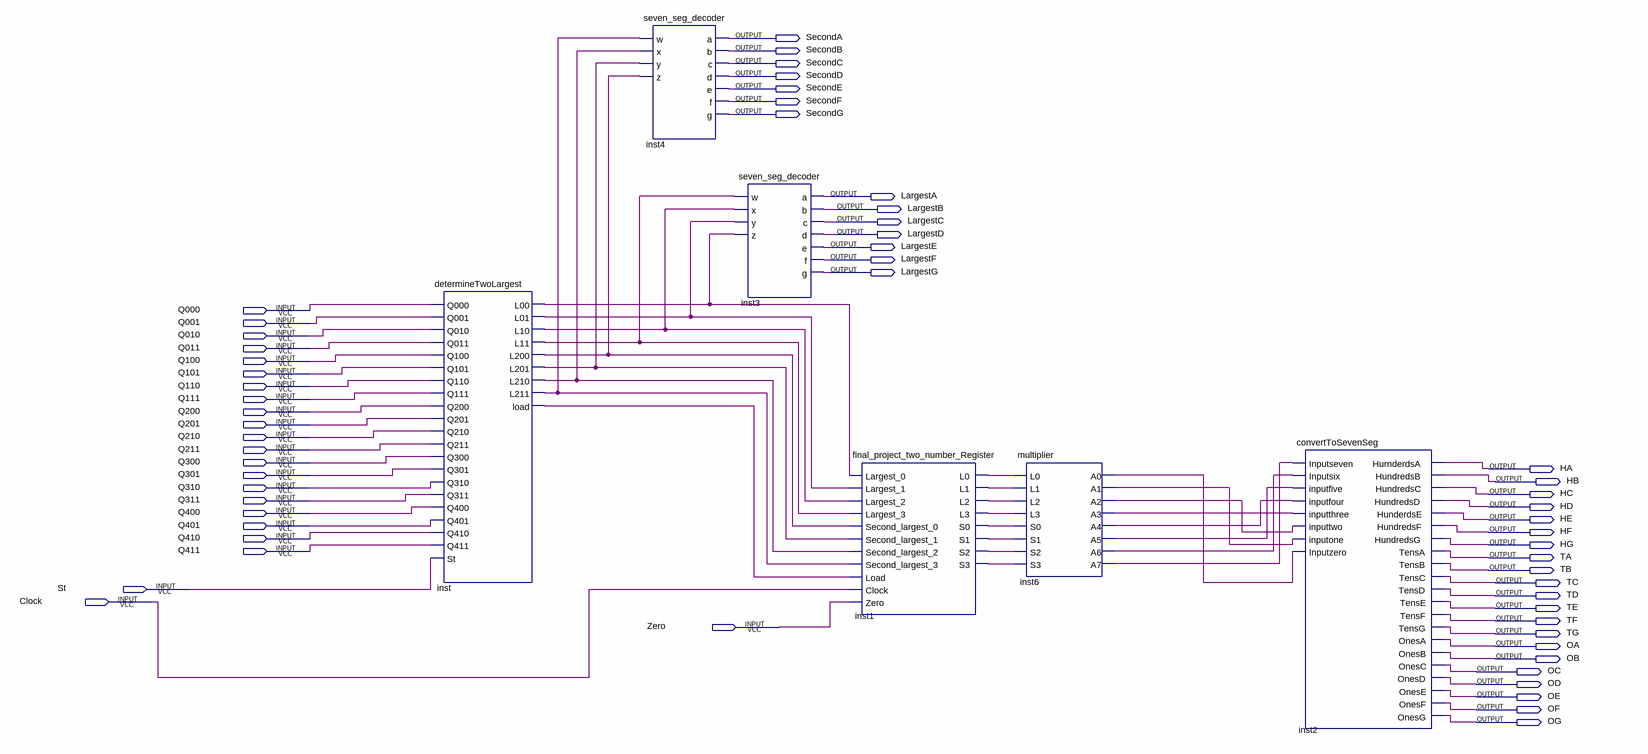
[diagram p0: schematic sheet]
// Quartus schematic Final_Project.bdf as structural Verilog: 6 symbols, 58 pins
module Final_Project (
  input  Q000,
  input  Q001,
  input  Q010,
  input  Q011,
  input  Q100,
  input  Q101,
  input  Q110,
  input  Q111,
  input  Q200,
  input  Q201,
  input  Q210,
  input  Q211,
  input  Q300,
  input  Q301,
  input  Q310,
  input  Q311,
  input  Q400,
  input  Q401,
  input  Q410,
  input  Q411,
  input  St,
  input  Clock,
  input  Zero,
  output SecondA,
  output SecondB,
  output SecondC,
  output SecondD,
  output SecondE,
  output SecondF,
  output SecondG,
  output LargestA,
  output LargestB,
  output LargestC,
  output LargestD,
  output LargestE,
  output LargestF,
  output LargestG,
  output HA,
  output HB,
  output HC,
  output HD,
  output HE,
  output HF,
  output HG,
  output TA,
  output TB,
  output TC,
  output TD,
  output TE,
  output TF,
  output TG,
  output OA,
  output OB,
  output OC,
  output OD,
  output OE,
  output OF,
  output OG
);

  wire inst1_l0, inst1_l1, inst1_l2, inst1_l3, inst1_s0, inst1_s1, inst1_s2, inst1_s3, inst6_a0, inst6_a1,
       inst6_a2, inst6_a3, inst6_a4, inst6_a5, inst6_a6, inst6_a7, inst_l00, inst_l01, inst_l10, inst_l11,
       inst_l200, inst_l201, inst_l210, inst_l211, inst_load;

  determineTwoLargest inst (
    .Q000(Q000), .Q001(Q001), .Q010(Q010), .Q011(Q011), .Q100(Q100), .Q101(Q101), .Q110(Q110), .Q111(Q111),
    .Q200(Q200), .Q201(Q201), .Q210(Q210), .Q211(Q211), .Q300(Q300), .Q301(Q301), .Q310(Q310), .Q311(Q311),
    .Q400(Q400), .Q401(Q401), .Q410(Q410), .Q411(Q411), .St(St), .L00(inst_l00), .L01(inst_l01),
    .L10(inst_l10), .L11(inst_l11), .L200(inst_l200), .L201(inst_l201), .L210(inst_l210), .L211(inst_l211),
    .load(inst_load));
  seven_seg_decoder inst4 (
    .w(inst_l211), .x(inst_l210), .y(inst_l201), .z(inst_l200), .a(SecondA), .b(SecondB), .c(SecondC),
    .d(SecondD), .e(SecondE), .f(SecondF), .g(SecondG));
  seven_seg_decoder inst3 (
    .w(inst_l11), .x(inst_l10), .y(inst_l01), .z(inst_l00), .a(LargestA), .b(LargestB), .c(LargestC),
    .d(LargestD), .e(LargestE), .f(LargestF), .g(LargestG));
  final_project_two_number_Register inst1 (
    .Largest_0(inst_l00), .Largest_1(inst_l01), .Largest_2(inst_l10), .Largest_3(inst_l11),
    .Second_largest_0(inst_l200), .Second_largest_1(inst_l201), .Second_largest_2(inst_l210),
    .Second_largest_3(inst_l211), .Load(inst_load), .Clock(Clock), .Zero(Zero), .L0(inst1_l0), .L1(inst1_l1),
    .L2(inst1_l2), .L3(inst1_l3), .S0(inst1_s0), .S1(inst1_s1), .S2(inst1_s2), .S3(inst1_s3));
  multiplier inst6 (
    .L0(inst1_l0), .L1(inst1_l1), .L2(inst1_l2), .L3(inst1_l3), .S0(inst1_s0), .S1(inst1_s1), .S2(inst1_s2),
    .S3(inst1_s3), .A0(inst6_a0), .A1(inst6_a1), .A2(inst6_a2), .A3(inst6_a3), .A4(inst6_a4), .A5(inst6_a5),
    .A6(inst6_a6), .A7(inst6_a7));
  convertToSevenSeg inst2 (
    .Inputseven(inst6_a7), .Inputsix(inst6_a6), .inputfive(inst6_a5), .inputfour(inst6_a4),
    .inputthree(inst6_a3), .inputtwo(inst6_a2), .inputone(inst6_a1), .Inputzero(inst6_a0), .HurnderdsA(HA),
    .HundredsB(HB), .HundredsC(HC), .HundredsD(HD), .HunderdsE(HE), .HundredsF(HF), .HundredsG(HG),
    .TensA(TA), .TensB(TB), .TensC(TC), .TensD(TD), .TensE(TE), .TensF(TF), .TensG(TG), .OnesA(OA),
    .OnesB(OB), .OnesC(OC), .OnesD(OD), .OnesE(OE), .OnesF(OF), .OnesG(OG));
endmodule
